# Altium schematic sheet KursSCH1.schdoc: Плата для мотора
size 420 x 297 mm; ApprovedBy: Рогов; CheckedBy: Капустин Д.А.; DrawnBy: Белозерцева А.Ю.; DocumentNumber: СПбПУ 12.03.2019 Э3; SheetNumber: 1; SheetTotal: 4; Title1str: ECX SPEED 22 L; DocumentType: Схема электрическая принципиальная; Format: A3; ImagePath: STM32F103R
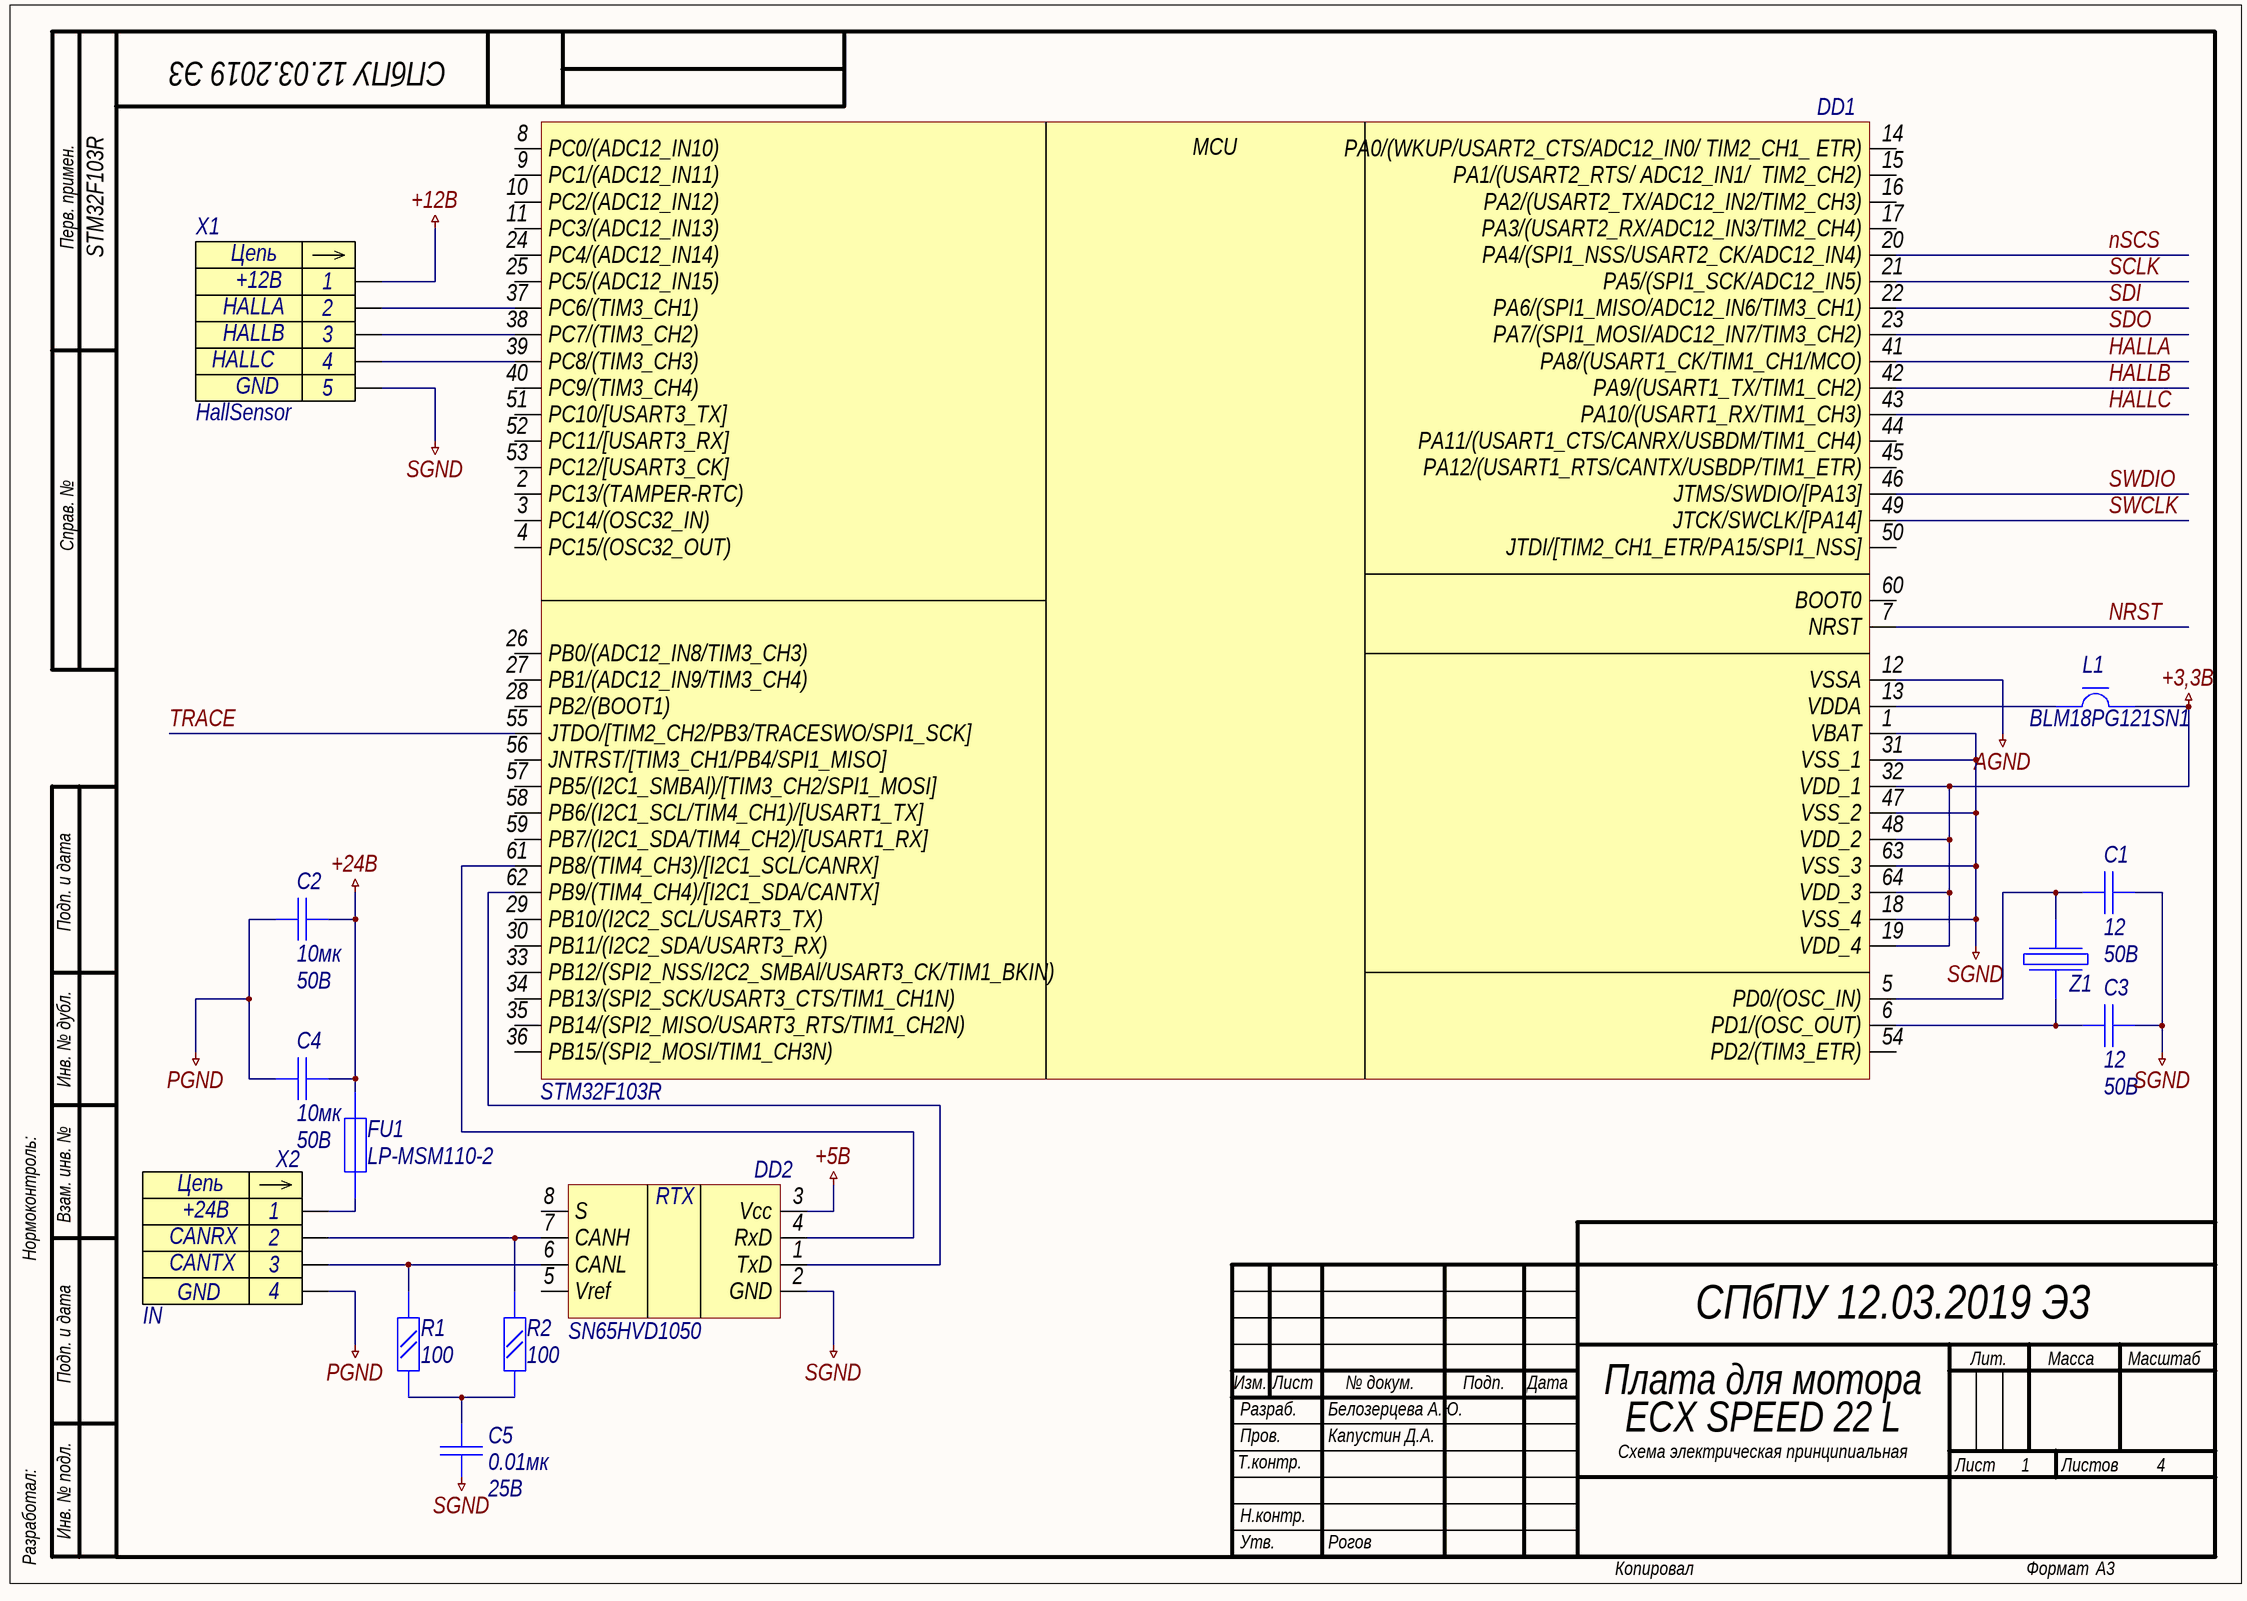
[diagram p0: KursSCH1.schdoc]

## Parts
C1  value 12  Voltage: 50В  [C0402]  (hidden comment: Capacitor)
C2  value 10мк  Voltage: 50В  [C1206]  (hidden comment: Capacitor)
C3  value 12  Voltage: 50В  [C0402]  (hidden comment: Capacitor)
C4  value 10мк  Voltage: 50В  [C1206]  (hidden comment: Capacitor)
C5  value 0.01мк  Voltage: 25В  [C0402]  (hidden comment: Capacitor)
DD1  STM32F103R
DD2  SN65HVD1050
FU1  value LP-MSM110-2  [F1812]  (hidden comment: Fuse)
L1  Part Number: BLM18PG121SN1  [L0603]  (hidden comment: FerriteBead)
R1  value 100  [R0805]  (hidden comment: Resistor_0,125W)
R2  value 100  [R0805]  (hidden comment: Resistor_0,125W)
X1  HallSensor  U: +12В  Hall1: HALLA  Hall2: HALLB  Hall3: HALLC  [USB]
X2  IN  U: +24В  Out: CANRX  In: CANTX
Z1  Crystal  [SX-3225]  (value not drawn)

## Nets
+3,3В: DD1.19(VDD_4) DD1.32(VDD_1) DD1.48(VDD_2) DD1.64(VDD_3) L1.2
+5В: DD2.3(Vcc)
+12В: X1.1
+24В: C2.2 C4.2 FU1.2
AGND: DD1.12(VSSA)
PGND: C2.1 C4.1 X2.4
SGND: C1.1 C3.1 C5.1 DD1.1(VBAT) DD1.18(VSS_4) DD1.31(VSS_1) DD1.47(VSS_2) DD1.63(VSS_3) DD2.2(GND) X1.5
HALLA: DD1.41(PA8/(USART1_CK/TIM1_CH1/MCO))
HALLB: DD1.42(PA9/(USART1_TX/TIM1_CH2))
HALLC: DD1.43(PA10/(USART1_RX/TIM1_CH3))
NRST: DD1.7(NRST)
nSCS: DD1.20(PA4/(SPI1_NSS/USART2_CK/ADC12_IN4))
SCLK: DD1.21(PA5/(SPI1_SCK/ADC12_IN5))
SDI: DD1.22(PA6/(SPI1_MISO/ADC12_IN6/TIM3_CH1))
SDO: DD1.23(PA7/(SPI1_MOSI/ADC12_IN7/TIM3_CH2))
SWCLK: DD1.49(JTCK/SWCLK/[PA14])
SWDIO: DD1.46(JTMS/SWDIO/[PA13])
TRACE: DD1.55(JTDO/[TIM2_CH2/PB3/TRACESWO/SPI1_SCK])
NetC1_2: C1.2 DD1.5(PD0/(OSC_IN)) Z1.3
NetC3_2: C3.2 DD1.6(PD1/(OSC_OUT)) Z1.1
NetC5_2: C5.2 R1.1 R2.1
NetDD1_13: DD1.13(VDDA) L1.1
NetDD1_37: DD1.37(PC6/(TIM3_CH1)) X1.2
NetDD1_38: DD1.38(PC7/(TIM3_CH2)) X1.3
NetDD1_39: DD1.39(PC8/(TIM3_CH3)) X1.4
NetDD1_61: DD1.61(PB8/(TIM4_CH3)/[I2C1_SCL/CANRX]) DD2.4(RxD)
NetDD1_62: DD1.62(PB9/(TIM4_CH4)/[I2C1_SDA/CANTX]) DD2.1(TxD)
NetDD2_6: DD2.6(CANL) R1.2 X2.3
NetDD2_7: DD2.7(CANH) R2.2 X2.2
NetFU1_1: FU1.1 X2.1

Not connected (* = marked no-connect by the designer): DD1 2(PC13/(TAMPER-RTC)) 3(PC14/(OSC32_IN)) 4(PC15/(OSC32_OUT)) 8(PC0/(ADC12_IN10)) 9(PC1/(ADC12_IN11)) 10(PC2/(ADC12_IN12)) 11(PC3/(ADC12_IN13)) 14(PA0/(WKUP/USART2_CTS/ADC12_IN0/_TIM2_CH1__ETR)) 15(PA1/(USART2_RTS/_ADC12_IN1/__TIM2_CH2)) 16(PA2/(USART2_TX/ADC12_IN2/TIM2_CH3)) 17(PA3/(USART2_RX/ADC12_IN3/TIM2_CH4)) 24(PC4/(ADC12_IN14)) 25(PC5/(ADC12_IN15)) 26(PB0/(ADC12_IN8/TIM3_CH3)) 27(PB1/(ADC12_IN9/TIM3_CH4)) 28(PB2/(BOOT1)) 29(PB10/(I2C2_SCL/USART3_TX)) 30(PB11/(I2C2_SDA/USART3_RX)) 33(PB12/(SPI2_NSS/I2C2_SMBAl/USART3_CK/TIM1_BKIN)) 34(PB13/(SPI2_SCK/USART3_CTS/TIM1_CH1N)) 35(PB14/(SPI2_MISO/USART3_RTS/TIM1_CH2N)) 36(PB15/(SPI2_MOSI/TIM1_CH3N)) 40(PC9/(TIM3_CH4)) 44(PA11/(USART1_CTS/CANRX/USBDM/TIM1_CH4)) 45(PA12/(USART1_RTS/CANTX/USBDP/TIM1_ETR)) 50(JTDI/[TIM2_CH1_ETR/PA15/SPI1_NSS]) 51(PC10/[USART3_TX]) 52(PC11/[USART3_RX]) 53(PC12/[USART3_CK]) 54(PD2/(TIM3_ETR)) 56(JNTRST/[TIM3_CH1/PB4/SPI1_MISO]) 57(PB5/(I2C1_SMBAl)/[TIM3_CH2/SPI1_MOSI]) 58(PB6/(I2C1_SCL/TIM4_CH1)/[USART1_TX]) 59(PB7/(I2C1_SDA/TIM4_CH2)/[USART1_RX]) 60(BOOT0); DD2 5(Vref) 8(S)

## Notes on the sheet
- Перв. примен.
- Справ. №
- Подп. и дата
- Инв. № дубл.
- Нормоконтроль:
- Взам. инв. №
- Изм.
- Лист
- № докум.
- Подп.
- Дата
- Лит.
- Масса
- Масштаб
- Т.контр.
- Пров.
- Разраб.
- Листов
- Разработал:
- Инв. № подл.
- Н.контр.
- Утв.
- Копировал
- Формат
- (in symbol HallSensor) Цепь
- (in symbol SN65HVD1050) RTX
- (in symbol STM32F103R) MCU
- (in symbol USB-B) Цепь

## Library data of the parts
C1 C3 = GRM1555C1H120JA01D: Manufacturer: Murata; Type: Конденсатор; ID: 159; Tolerance: ±5%; Dielectric Type: NP0; Part Number: GRM1555C1H120JA01D; Footprint: 0402
C2 C4 = GRM31CR61H106KA12L: Manufacturer: Murata; Type: Конденсатор; ID: 143; Tolerance: ±10%; Dielectric Type: X5R; Application Category: 1; Working Temperature Min: -55°С; Working Temperature Max: +85°С; Part Number: GRM31CR61H106KA12L; Footprint: 1206
C5 = GRM155R71E103KA01D: Manufacturer: Murata; Type: Конденсатор; ID: 150; Tolerance: ±10%; Dielectric Type: X7R; Part Number: GRM155R71E103KA01D; Footprint: 0402
FU1 = LP-MSM110-2: ID: 2; Limit Voltage: 6V; Rated Current: 1.1A; Resistance: 0.26ohm; Type: Вставка плавкая; Part Number: LP-MSM110-2
L1 = BLM18PG121SN1: Manufacturer: Murata; Type: Дроссель; ID: 4; Rated Current: 2A; Impedance at 100Mhz: 120ohm; DC Resistance: 0.05ohm; Inductor Type: EMIFIL; Application Category: 1; Working Temperature Min: -55°С; Working Temperature Max: +125°С; Published: 14.11.2014; Publisher: Andrew Danich; Value: BLM18PG121SN1; Footprint: 0603
R1 R2 = RC0805JR-07100RL: Manufacturer: Yageo; ID: 97; Limit Voltage: 150V; Tolerance: ±5%; Temperature Coefficient: 100ppm; Total Power Dissipation: 0.125W; Series Type: Thick-Film; Application Category: 1; Working Temperature Min: -55°С; Working Temperature Max: +155°С; Type: Резистор; Part Number: RC0805JR-07100RL; Footprint: 0805
X1 = HallSensor: Create: DeathSpeaker; GND: GND
X2 = USB-B: Create: DeathSpeaker; GND: GND
Z1 = SX-3225 16.000MHz: ID: 15; Output Frequency: 16МГц; Shunt Capacitance: 5pF; Load Capacitance: 10pF; Application Category: 1; Published: 08.03.2013; Publisher: Andrew Danich; Type: Резонатор; Part Number: SX-3225 16.000MHz; Value: SX-3225 16.000MHz